# EAGLE design TicTocTrac_top_v1.0 (EAGLE 6.1)
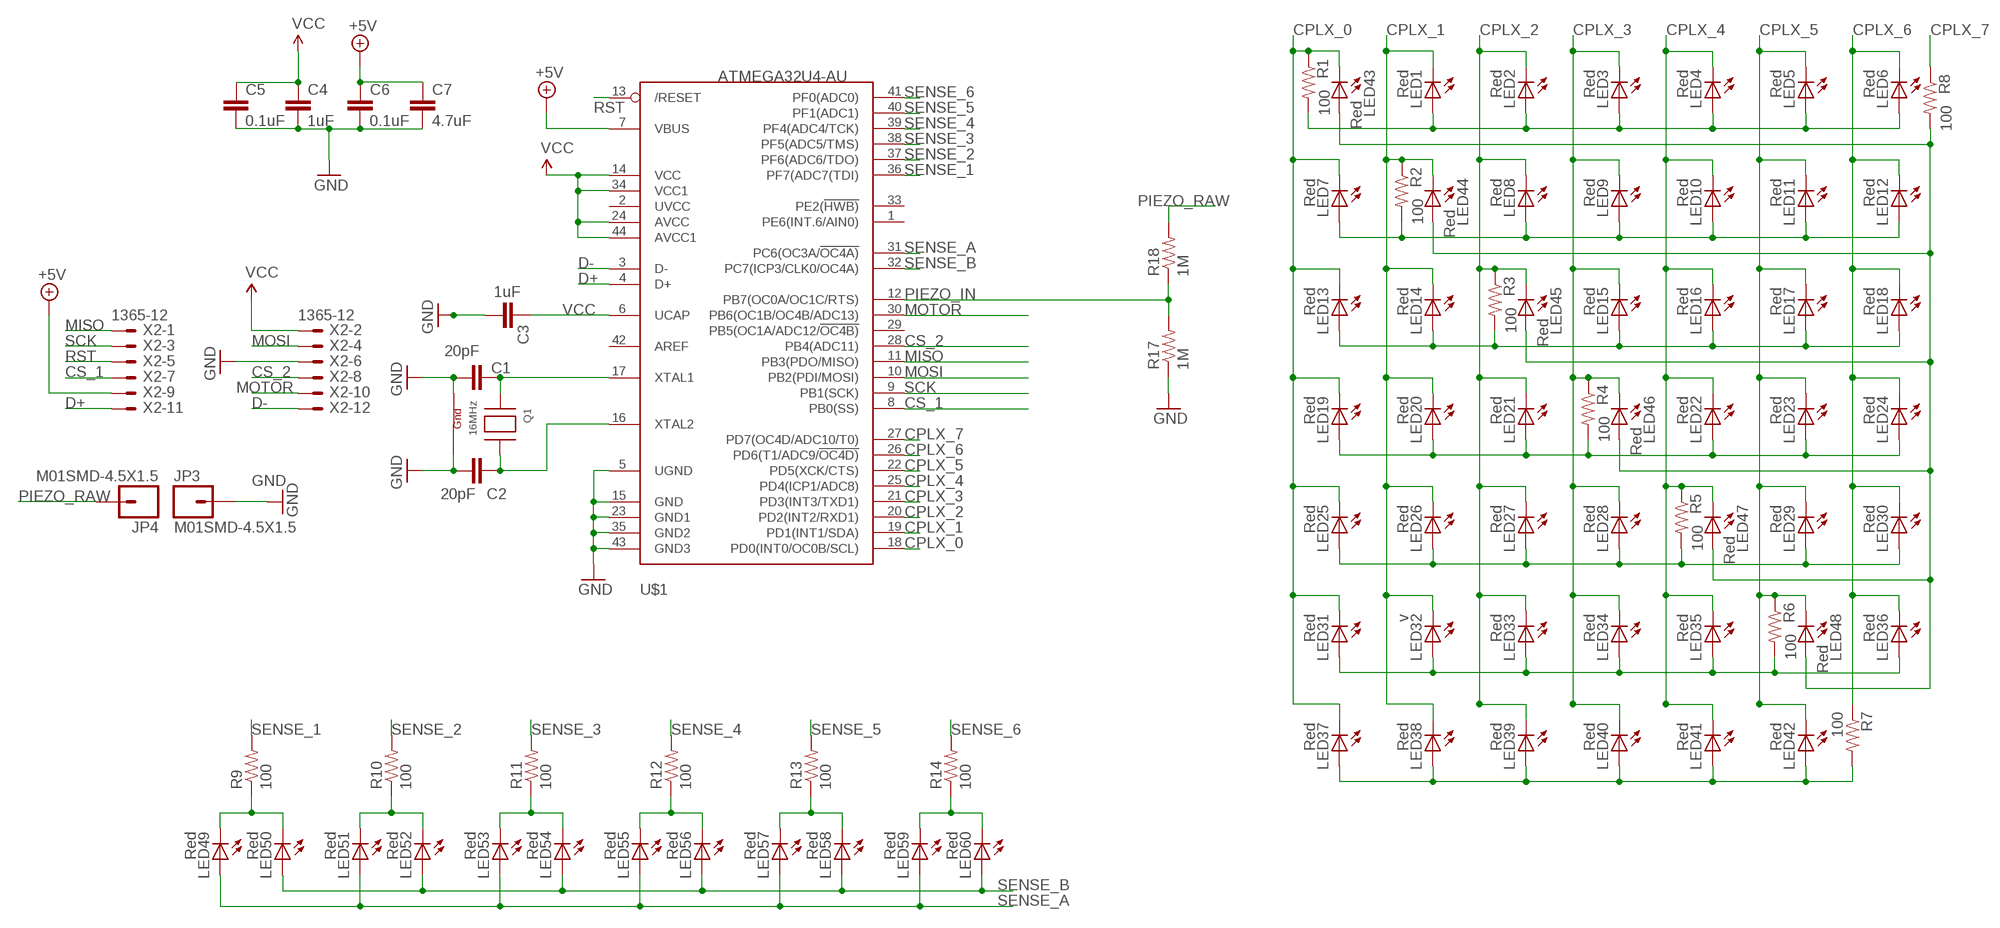
[diagram p0: schematic, sheet 1]

## Parts
C1  20pF  CAP0402-CAP  [0402-CAP]
C2  20pF  CAP0402-CAP  [0402-CAP]
C3  1uF  CAP0402-CAP  [0402-CAP]
C4  1uF  CAP0402-CAP  [0402-CAP]
C5  0.1uF  CAP0402-CAP  [0402-CAP]
C6  0.1uF  CAP0402-CAP  [0402-CAP]
C7  4.7uF  CAP0402-CAP  [0402-CAP]
JP3  M01SMD-4.5X1.5  [PAD-1.5X4.5]
JP4  M01SMD-4.5X1.5  [PAD-1.5X4.5]
LED1  Red  LED0603  [LED-0603]
LED2  Red  LED0603  [LED-0603]
LED3  Red  LED0603  [LED-0603]
LED4  Red  LED0603  [LED-0603]
LED5  Red  LED0603  [LED-0603]
LED6  Red  LED0603  [LED-0603]
LED7  Red  LED0603  [LED-0603]
LED8  Red  LED0603  [LED-0603]
LED9  Red  LED0603  [LED-0603]
LED10  Red  LED0603  [LED-0603]
LED11  Red  LED0603  [LED-0603]
LED12  Red  LED0603  [LED-0603]
LED13  Red  LED0603  [LED-0603]
LED14  Red  LED0603  [LED-0603]
LED15  Red  LED0603  [LED-0603]
LED16  Red  LED0603  [LED-0603]
LED17  Red  LED0603  [LED-0603]
LED18  Red  LED0603  [LED-0603]
LED19  Red  LED0603  [LED-0603]
LED20  Red  LED0603  [LED-0603]
LED21  Red  LED0603  [LED-0603]
LED22  Red  LED0603  [LED-0603]
LED23  Red  LED0603  [LED-0603]
LED24  Red  LED0603  [LED-0603]
LED25  Red  LED0603  [LED-0603]
LED26  Red  LED0603  [LED-0603]
LED27  Red  LED0603  [LED-0603]
LED28  Red  LED0603  [LED-0603]
LED29  Red  LED0603  [LED-0603]
LED30  Red  LED0603  [LED-0603]
LED31  Red  LED0603  [LED-0603]
LED32  v  LED0603  [LED-0603]
LED33  Red  LED0603  [LED-0603]
LED34  Red  LED0603  [LED-0603]
LED35  Red  LED0603  [LED-0603]
LED36  Red  LED0603  [LED-0603]
LED37  Red  LED0603  [LED-0603]
LED38  Red  LED0603  [LED-0603]
LED39  Red  LED0603  [LED-0603]
LED40  Red  LED0603  [LED-0603]
LED41  Red  LED0603  [LED-0603]
LED42  Red  LED0603  [LED-0603]
LED43  Red  LED0603  [LED-0603]
LED44  Red  LED0603  [LED-0603]
LED45  Red  LED0603  [LED-0603]
LED46  Red  LED0603  [LED-0603]
LED47  Red  LED0603  [LED-0603]
LED48  Red  LED0603  [LED-0603]
LED49  Red  LED0603  [LED-0603]
LED50  Red  LED0603  [LED-0603]
LED51  Red  LED0603  [LED-0603]
LED52  Red  LED0603  [LED-0603]
LED53  Red  LED0603  [LED-0603]
LED54  Red  LED0603  [LED-0603]
LED55  Red  LED0603  [LED-0603]
LED56  Red  LED0603  [LED-0603]
LED57  Red  LED0603  [LED-0603]
LED58  Red  LED0603  [LED-0603]
LED59  Red  LED0603  [LED-0603]
LED60  Red  LED0603  [LED-0603]
Q1  16MHz  XTAL-4-3225  [NX3225]
R1  100  RESISTOR0402-RES  [0402-RES]
R2  100  RESISTOR0402-RES  [0402-RES]
R3  100  RESISTOR0402-RES  [0402-RES]
R4  100  RESISTOR0402-RES  [0402-RES]
R5  100  RESISTOR0402-RES  [0402-RES]
R6  100  RESISTOR0402-RES  [0402-RES]
R7  100  RESISTOR0402-RES  [0402-RES]
R8  100  RESISTOR0402-RES  [0402-RES]
R9  100  RESISTOR0402-RES  [0402-RES]
R10  100  RESISTOR0402-RES  [0402-RES]
R11  100  RESISTOR0402-RES  [0402-RES]
R12  100  RESISTOR0402-RES  [0402-RES]
R13  100  RESISTOR0402-RES  [0402-RES]
R14  100  RESISTOR0402-RES  [0402-RES]
R17  1M  RESISTOR0805-RES  [0805]
R18  1M  RESISTOR0805-RES  [0805]
U$1  ATMEGA32U4-AU  [TQFP44]
X2  1365-12  [1365-12]

## Nets
+5V: C6.1 C7.1 U$1.7(VBUS) X2.9
CPLX_0: LED7.C LED13.C LED19.C LED25.C LED31.C LED37.C LED43.C R1.1 U$1.18(PD0(INT0/OC0B/SCL))
CPLX_1: LED1.C LED14.C LED20.C LED26.C LED32.C LED38.C LED44.C R2.1 U$1.19(PD1(INT1/SDA))
CPLX_2: LED2.C LED8.C LED21.C LED27.C LED33.C LED39.C LED45.C R3.1 U$1.20(PD2(INT2/RXD1))
CPLX_3: LED3.C LED9.C LED15.C LED28.C LED34.C LED40.C LED46.C R4.1 U$1.21(PD3(INT3/TXD1))
CPLX_4: LED4.C LED10.C LED16.C LED22.C LED35.C LED41.C LED47.C R5.1 U$1.25(PD4(ICP1/ADC8))
CPLX_5: LED5.C LED11.C LED17.C LED23.C LED29.C LED42.C LED48.C R6.1 U$1.22(PD5(XCK/CTS))
CPLX_6: LED6.C LED12.C LED18.C LED24.C LED30.C LED36.C R7.1 U$1.26(PD6(T1/ADC9/!OC4D))
CPLX_7: R8.1 U$1.27(PD7(OC4D/ADC10/T0))
CS_1: U$1.8(PB0(SS)) X2.7
CS_2: U$1.28(PB4(ADC11)) X2.8
D+: U$1.4(D+) X2.11
D-: U$1.3(D-) X2.12
GND: C1.2 C2.2 C3.2 C4.2 C5.2 C6.2 C7.2 JP3.P$1 Q1.2(G2) Q1.4(G1) R17.1 U$1.5(UGND) U$1.15(GND) U$1.23(GND1) U$1.35(GND2) U$1.43(GND3) X2.6
MISO: U$1.11(PB3(PDO/MISO)) X2.1
MOSI: U$1.10(PB2(PDI/MOSI)) X2.4
MOTOR: U$1.30(PB6(OC1B/OC4B/ADC13)) X2.10
N$2: C2.1 Q1.3(X2) U$1.16(XTAL2)
N$6: C1.1 Q1.1(X1) U$1.17(XTAL1)
N$12: LED19.A LED20.A LED21.A LED22.A LED23.A LED24.A R4.2
N$13: LED1.A LED2.A LED3.A LED4.A LED5.A LED6.A R1.2
N$14: LED7.A LED8.A LED9.A LED10.A LED11.A LED12.A R2.2
N$15: LED25.A LED26.A LED27.A LED28.A LED29.A LED30.A R5.2
N$16: LED13.A LED14.A LED15.A LED16.A LED17.A LED18.A R3.2
N$17: LED43.A LED44.A LED45.A LED46.A LED47.A LED48.A R8.2
N$18: LED37.A LED38.A LED39.A LED40.A LED41.A LED42.A R7.2
N$19: LED31.A LED32.A LED33.A LED34.A LED35.A LED36.A R6.2
N$21: LED49.C LED50.C R9.1
N$22: LED51.C LED52.C R10.1
N$23: LED53.C LED54.C R11.1
N$24: LED55.C LED56.C R12.1
N$25: LED57.C LED58.C R13.1
N$26: LED59.C LED60.C R14.1
PIEZO_IN: R17.2 R18.1 U$1.12(PB7(OC0A/OC1C/RTS))
PIEZO_RAW: JP4.P$1 R18.2
RST: U$1.13(/RESET) X2.5
SCK: U$1.9(PB1(SCK)) X2.3
SENSE_1: R9.2 U$1.36(PF7(ADC7(TDI))
SENSE_2: R10.2 U$1.37(PF6(ADC6/TDO))
SENSE_3: R11.2 U$1.38(PF5(ADC5/TMS))
SENSE_4: R12.2 U$1.39(PF4(ADC4/TCK))
SENSE_5: R13.2 U$1.40(PF1(ADC1))
SENSE_6: R14.2 U$1.41(PF0(ADC0))
SENSE_A: LED49.A LED51.A LED53.A LED55.A LED57.A LED59.A U$1.31(PC6(OC3A/!OC4A))
SENSE_B: LED50.A LED52.A LED54.A LED56.A LED58.A LED60.A U$1.32(PC7(ICP3/CLK0/OC4A))
VCC: C3.1 C4.1 C5.1 U$1.6(UCAP) U$1.14(VCC) U$1.24(AVCC) U$1.34(VCC1) U$1.44(AVCC1) X2.2
Unconnected: U$1.1(PE6(INT.6/AIN0)) U$1.2(UVCC) U$1.29(PB5(OC1A/ADC12/!OC4B)) U$1.33(PE2(!HWB)) U$1.42(AREF)

## Library data of the parts
C1-C7 = SparkFun:CAP: Capacitor Standard 0603 ceramic capacitor, and 0.1" leaded capacitor.
JP3 JP4 = SparkFun-Connectors:M01: Header 1 Standard 1-pin 0.1" header. Use with straight break away headers (SKU : PRT-00116), right angle break away headers (PRT-00553), swiss pins (PRT-00743), machine pins (PRT-00117), and female headers (PRT-00115).
LED1-LED60 = SparkFun:LED: LEDs Standard schematic elements and footprints for 5mm, 3mm, 1206, and 0603 sized LEDs. 5mm - Spark Fun Electronics SKU : COM-00529 (and others)
Q1 = adafruit:XTAL-4: Classic 4-pin 3.2 x 2.5mm crystal
R1-R14 R17 R18 = SparkFun:RESISTOR: Resistor Basic schematic elements and footprints for 0603, 1206, and PTH resistors.
U$1 = adafruit:ATMEGA32U4: http://www.ladyada.net/library/eagle
X2 = con-leotronics:1365-12: DUAL ROW STRAIGHT HEADER 1364 SERIES. 1.27mm x 1.27mm. Without Fixing Post. SMT Source: http://www.leotronics.co.uk/Conexcon/Data%20Sheets/sec.%20A/1364ing.pdf; OC_FARNELL: unknown; OC_NEWARK: unknown

## Board
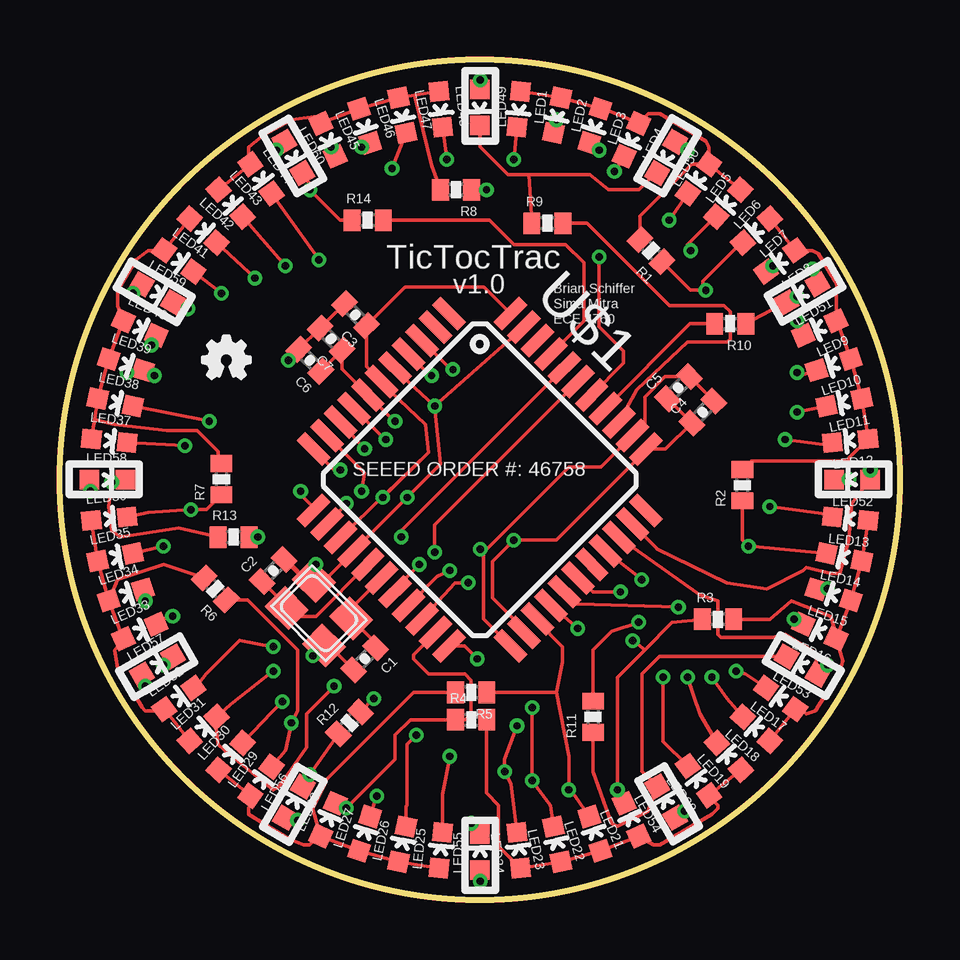
[diagram p1: board, top side]
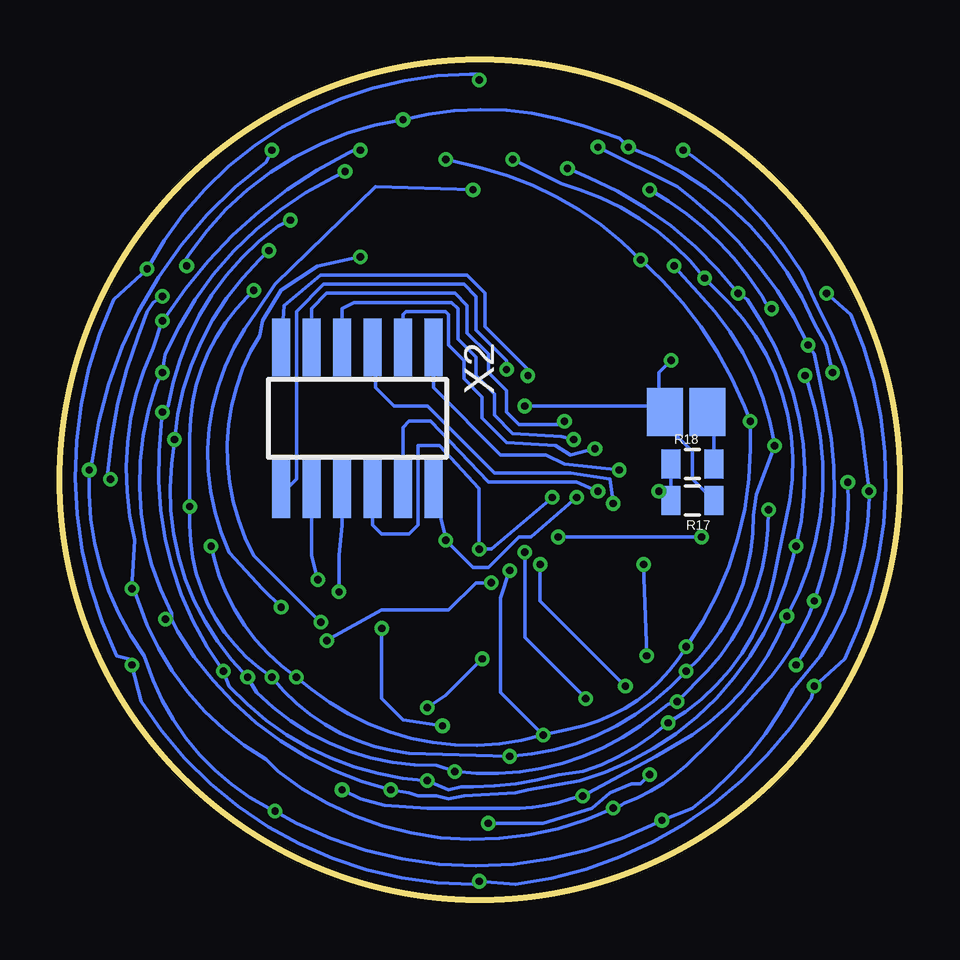
[diagram p2: board, bottom side, seen from below]

Size 35 x 35 mm. Coordinates in mm from the lower left corner, seen from the top.
Outline: circle at 17.5,17.5 radius 17.5
Copper layers (1*16): Top 0.035mm / dielectric 1.5mm / Bottom 0.035mm
Design rules: minimum track width 6mil, minimum drill 12mil, track to track 6mil, track to pad 6mil, pad to pad 6mil, via to via 6mil, smd to smd 0mil, copper to edge 10mil, drill to drill 10mil, minimum pad ring 10mil, minimum via ring 6mil, stop-mask expansion 2mil, vias tented up to drill 100mil, thermal gap 10mil

### Footprints (pad centres in the part's own frame; a part is rotated, then mirrored left to right if it is on the bottom)
0402-CAP = smd 0.7 x 0.9: 1 -0.65,0; 2 0.65,0
PAD-1.5X4.5 = smd 1.5 x 2: P$1 0,0
LED-0603 = smd 0.8 x 0.8: A 0,-0.75; C 0,0.75
NX3225 = smd 1.4 x 1.2: 1 -1.1,-0.8; 2 1.1,-0.8; 3 1.1,0.8; 4 -1.1,0.8
0402-RES = smd 0.7 x 0.9: 1 -0.65,0; 2 0.65,0
0805 = smd 0.8 x 1.2: 1 -0.9,0; 2 0.9,0
TQFP44 = smd 1.5 x 0.5: 1 -5.8,4; 2 -5.8,3.2; 3 -5.8,2.4; 4 -5.8,1.6; 5 -5.8,0.8; 6 -5.8,0; 7 -5.8,-0.8; 8 -5.8,-1.6; 9 -5.8,-2.4; 10 -5.8,-3.2; 11 -5.8,-4; 23 5.8,-4; 24 5.8,-3.2; 25 5.8,-2.4; 26 5.8,-1.6; 27 5.8,-0.8; 28 5.8,0; 29 5.8,0.8; 30 5.8,1.6; 31 5.8,2.4; 32 5.8,3.2; 33 5.8,4 | smd 0.5 x 1.5: 12 -4,-5.8; 13 -3.2,-5.8; 14 -2.4,-5.8; 15 -1.6,-5.8; 16 -0.8,-5.8; 17 0,-5.8; 18 0.8,-5.8; 19 1.6,-5.8; 20 2.4,-5.8; 21 3.2,-5.8; 22 4,-5.8; 34 4,5.8; 35 3.2,5.8; 36 2.4,5.8; 37 1.6,5.8; 38 0.8,5.8; 39 0,5.8; 40 -0.8,5.8; 41 -1.6,5.8; 42 -2.4,5.8; 43 -3.2,5.8; 44 -4,5.8
1365-12 = smd 0.76 x 2.4: 1 -3.175,-2.95; 2 -3.175,2.95; 3 -1.905,-2.95; 4 -1.905,2.95; 5 -0.635,-2.95; 6 -0.635,2.95; 7 0.635,-2.95; 8 0.635,2.95; 9 1.905,-2.95; 10 1.905,2.95; 11 3.175,-2.95; 12 3.175,2.95

### Placement (x,y rotation side)
C1  12.7,10.03 225 top
C2  8.89,13.72 45 top
C3  12.32,24.38 135 top
C4  26.8,20.32 45 top
C5  25.78,21.34 45 top
C6  10.41,22.48 135 top
C7  11.3,23.37 135 top
JP3  9.78,20.32 0 bottom
JP4  8,20.32 0 bottom
LED1  19.13,32.94 174 top
LED2  20.73,32.69 168 top
LED3  22.3,32.26 162 top
LED4  23.82,31.67 156 top
LED5  26.62,30.05 144 top
LED6  27.86,29.03 138 top
LED7  29.03,27.89 132 top
LED8  30.05,26.62 126 top
LED9  31.67,23.82 114 top
LED10  32.26,22.3 108 top
LED11  32.69,20.73 102 top
LED12  32.94,19.13 96 top
LED13  32.94,15.87 84 top
LED14  32.69,14.27 78 top
LED15  32.26,12.7 72 top
LED16  31.67,11.18 66 top
LED17  30.05,8.38 54 top
LED18  29.03,7.11 48 top
LED19  27.89,5.97 42 top
LED20  26.62,4.95 36 top
LED21  23.82,3.33 24 top
LED22  22.3,2.74 18 top
LED23  20.73,2.31 12 top
LED24  19.13,2.06 6 top
LED25  15.87,2.06 354 top
LED26  14.27,2.31 348 top
LED27  12.7,2.74 342 top
LED28  11.18,3.33 336 top
LED29  8.38,4.93 324 top
LED30  7.11,5.97 318 top
LED31  5.97,7.11 312 top
LED32  4.95,8.38 306 top
LED33  3.33,11.18 294 top
LED34  2.74,12.7 288 top
LED35  2.31,14.27 282 top
LED36  2.06,15.87 276 top
LED37  2.06,19.13 264 top
LED38  2.31,20.73 258 top
LED39  2.74,22.3 252 top
LED40  3.33,23.82 246 top
LED41  4.95,26.62 234 top
LED42  5.97,27.89 228 top
LED43  7.11,29.03 222 top
LED44  8.38,30.05 216 top
LED45  11.18,31.67 204 top
LED46  12.7,32.26 198 top
LED47  14.27,32.69 192 top
LED48  15.87,32.94 186 top
LED49  17.5,33.02 180 top
LED50  25.27,30.94 150 top
LED51  30.94,25.27 120 top
LED52  33.02,17.5 90 top
LED53  30.94,9.75 60 top
LED54  25.27,4.06 30 top
LED55  17.5,1.98 0 top
LED56  9.75,4.06 330 top
LED57  4.06,9.75 300 top
LED58  1.98,17.5 270 top
LED59  4.06,25.27 240 top
LED60  9.73,30.94 210 top
Q1  10.79,11.94 135 top
R1  24.64,27.05 135 top
R2  28.45,17.27 90 top
R3  27.43,11.68 0 top
R4  17.14,7.49 0 top
R5  17.14,8.64 180 top
R6  6.48,12.95 135 top
R7  6.73,17.53 90 top
R8  16.51,29.59 180 top
R9  20.32,28.19 0 top
R10  27.94,24 180 top
R11  22.22,7.62 90 top
R12  12.06,7.37 45 top
R13  7.24,15.11 0 top
R14  12.83,28.32 0 top
R17  8.64,16.64 180 bottom
R18  8.64,18.16 0 bottom
U$1  17.5,17.5 315 top
U$2  [OSHW_FILLX70_NOTEXT]  5.94,21.72 0 top
X2  22.61,20.07 180 bottom

### Tracks (layer width: path | path; a pad name or v marks a point on that pad's centre or on a via)
+5V  (via drill 0.3)
  Top 0.152: C6.1 C7.1 11.76,22.11 U$1.7 13.93,19.94 v13.97,19.94
  Bottom 0.152: v13.97,19.94 14.1,19.81 15.87,19.81 16.38,20.32 16.38,21.21 17.14,21.97 17.14,22.73 18.03,23.62 18.03,24.76 18.54,25.27 23.88,25.27 24.51,24.64 X2.9
CPLX_0  (via drill 0.3)
  Top 0.152: LED7.C 28.4,27.39 26.8,25.78 26.8,25.53 v26.92,25.4 26.29,25.4 R1.1 | v29.59,16.38 32.38,16 32.26,16 LED13.C | v26.16,9.27 26.67,7.75 LED19.C | LED25.C 15.95,4.4 v16.26,5.97 | v8.89,9.52 7.11,8.13 LED31.C 6.48,7.49 6.6,6.48 6.86,6.22 8.89,4.57 9.14,4.7 10.29,6.35 10.29,7.75 v11.43,8.89 | LED37.C v5.21,18.92 | LED43.C v9.4,26.42 | U$1.18 13.96,12.95 v14.99,13.97
  Bottom 0.152: v26.92,25.4 27.18,25.15 arc-45 29.59,19.3 v29.59,16.38 29.59,15.62 arc-57 v26.16,9.27 arc-46 20.45,6.1 v16.26,5.97 arc-44 v8.89,9.52 arc-49 6.1,16 5.97,16.89 v5.21,18.92 arc-36 8.38,25.27 v9.4,26.42 | v14.99,13.97 14.99,12.45 v11.43,8.89
CPLX_1  (via drill 0.3)
  Top 0.152: LED14.C v28.7,14.73 28.45,14.99 R2.1 | v25.15,9.27 25.15,6.6 26.18,5.57 LED20.C | v14.86,6.86 14.48,6.48 14.48,3.94 14.43,3.89 LED26.C | v8.89,10.54 7.49,10.79 6.1,9.4 5.59,8.76 | 5.59,8.76 5.59,8.89 | 5.59,8.76 LED32.C | LED38.C v6.22,19.94 | v10.79,26.67 8.89,29.34 | 8.89,29.34 8.89,29.46 | LED44.C 8.89,29.34 | LED1.C v18.92,30.86 | U$1.19 15.72,13.46 v16.26,13.72
  Bottom 0.152: v28.7,14.73 28.57,14.22 arc-41 v25.15,9.27 24.51,8.76 arc-55 v14.86,6.86 | v14.86,6.86 13.72,7.11 arc-48 v8.89,10.54 arc-35 6.22,18.8 v6.22,19.94 6.48,20.57 arc-27 v10.79,26.67 arc-32 17.4,30.48 v18.92,30.86 | v16.26,13.72 16.64,12.57 16.64,8.64 v14.86,6.86
CPLX_2  (via drill 0.3)
  Top 0.152: LED27.C v13.21,4.32 | v4.7,11.81 4.7,11.94 3.94,11.43 LED33.C 4.08,11.53 | LED21.C v23.24,4.57 23.24,9.27 24.38,10.41 | LED39.C v3.94,21.84 v2.79,21.97 | LED8.C v29.72,26.42 | v20.7,32.51 20.83,32.51 20.57,32 LED2.C | LED45.C v11.3,31.37 | 24.38,10.41 25.51,11.56 R3.1 | U$1.20 16.47,13.21 v17.02,13.21 | 23.88,10.92 v23.88,10.79 24.38,10.41
  Bottom 0.152: v23.24,4.57 22.48,4.19 21.46,3.94 19.68,3.81 16.38,3.81 arc-21 13.72,4.19 v13.21,4.32 10.16,5.97 8.64,6.86 arc-35 v4.7,11.81 arc-47 3.81,21.46 v3.94,21.84 | v29.72,26.42 29.84,26.54 29.59,26.92 arc47 v20.7,32.51 arc33 13.21,32.26 11.68,31.75 v11.3,31.37 arc47 3.56,24 3.05,23.11 v2.79,21.97 | v23.88,10.79 21.59,12.06 18.8,12.06 17.65,13.21 v17.02,13.21
CPLX_3  (via drill 0.3)
  Top 0.152: LED3.C 22.22,31.24 v22.48,31.24 | v30.73,24.13 30.73,24 LED9.C | LED15.C v32,12.95 | LED28.C v11.94,3.81 13.97,5.84 13.97,6.86 14.6,7.49 R4.1 16.89,7.49 17.14,7.75 17.14,9.14 16.89,9.4 15.37,9.4 14.73,10.03 14.73,10.21 U$1.21 | LED34.C v3.56,12.45 | LED40.C v3.81,23.11 | LED46.C v12.57,31.37
  Bottom 0.152: v22.48,31.24 22.73,31.24 22.99,31.11 arc-31 30.61,24.26 v30.73,24.13 31.11,22.99 arc-39 31.88,14.99 v32,12.95 32,13.21 31.75,12.45 arc-41 26.42,5.84 25.91,5.33 arc-64 v11.94,3.81 arc-22 LED28.C arc-22 8.89,5.59 arc-6 5.84,8.76 arc-20 3.81,11.81 v3.56,12.45 arc-32 3.05,20.32 3.56,22.73 v3.81,23.11 arc-26 8.64,29.21 9.27,29.72 v12.57,31.37
CPLX_4  (via drill 0.3)
  Top 0.152: LED4.C v23.11,30.35 | v30.73,21.97 30.86,21.84 LED10.C | LED16.C 30.99,11.68 v30.61,11.68 | LED22.C 21.46,4.32 v21.21,4.57 21.21,5.97 20.7,8.64 | LED35.C v4.32,14.73 | LED41.C v6.73,25.27 | LED47.C v13.84,30.48 | R5.1 20.7,8.64 | 20.7,8.64 20.95,9.91 20.95,10.54 19.9,11.59 U$1.25
  Bottom 0.152: v23.11,30.35 23.62,30.1 arc-40 30.61,22.73 v30.73,21.97 30.99,21.46 arc-47 30.35,11.94 30.35,11.68 | v30.61,11.68 30.35,11.68 | 30.35,11.68 30.1,11.18 arc-45 v21.21,4.57 20.45,4.44 20.07,4.32 19.3,4.32 18.8,4.19 18.16,4.32 16,4.44 15.49,4.57 13.33,4.95 arc-60 4.44,14.22 v4.32,14.73 arc-45 5.71,24 6.35,25.02 v6.73,25.27 arc-29 12.95,30.1 v13.84,30.48
CPLX_5  (via drill 0.3)
  Top 0.152: LED5.C v25.4,28.32 | v28.19,9.52 28.57,9.4 LED17.C | v30.73,20.32 LED11.C | LED23.C 20.45,3.94 v19.68,4.95 v19.68,8 | LED29.C 9.4,6.22 v9.65,7.37 9.91,7.87 9.91,10.41 7.83,12.49 R6.1 | LED42.C v8.13,25.91 | LED48.C v16.13,30.86 | U$1.22 16.86,10.57 v17.4,10.03
  Bottom 0.152: v25.4,28.32 25.91,28.07 arc-45 30.48,20.57 v30.73,20.32 30.86,18.67 arc-40 v28.19,9.52 27.94,8.89 arc-44 v19.68,4.95 18.8,4.57 18.29,4.7 17.78,4.7 arc-16 14.22,5.21 13.21,5.33 arc-23 v9.65,7.37 arc-52 5.08,14.22 arc-2 4.57,16.64 arc-53 7.11,24.89 v8.13,25.91 arc-34 13.33,29.59 14.1,29.84 v16.13,30.86 | v17.4,10.03 18.92,8.51 v19.68,8
CPLX_6  (via drill 0.3)
  Top 0.152: LED6.C 27.33,28.47 26.16,27.3 26.16,27.18 v26.29,27.05 | 32.07,18.92 LED12.C 32.13,18.92 v30.23,19.18 | v27.18,9.27 27.81,8.38 LED18.C | LED24.C 18.92,3.81 18.8,4.83 v18.54,5.33 18.54,5.84 v19.05,7.24 | LED30.C v9.27,8.25 | LED36.C 3.68,16.13 v5.46,16.26 6.11,16.26 R7.1 | U$1.26 v21.59,11.3
  Bottom 0.152: v26.29,27.05 26.67,26.67 arc-41 v30.23,19.18 30.35,18.16 arc-51 v27.18,9.27 26.8,8.64 arc-46 19.3,5.59 v18.54,5.33 arc-42 10.79,7.24 9.65,8.13 v9.27,8.25 8,9.52 arc-43 v5.46,16.26 | v21.59,11.3 21.59,8.38 20.7,7.49 v19.05,7.24
CPLX_7  (via drill 0.3)
  Top 0.152: R8.1 v17.78,29.59 | v25.78,12.19 21.55,12.32 U$1.27
  Bottom 0.152: v17.78,29.59 21.84,29.72 26.03,25.65 26.8,24.51 arc-63 27.94,14.48 26.54,12.95 v25.78,12.19
CS_1  (via drill 0.3)
  Top 0.152: U$1.8 13.56,19.18 v13.59,19.18
  Bottom 0.152: v13.59,19.18 14.1,19.3 16.13,19.43 16.89,20.19 16.89,21.08 17.65,21.84 17.65,22.61 18.41,23.37 18.41,24.64 18.67,24.89 22.73,24.89 23.24,24.64 X2.7
CS_2  (via drill 0.3)
  Top 0.152: U$1.28 22.22,12.83 v23.37,12.83
  Bottom 0.152: v23.37,12.83 23.37,14.35 23.24,15.62 X2.8 23.24,15.75
D+  (via drill 0.3)
  Top 0.152: U$1.4 15.42,21.84 v15.49,21.84
  Bottom 0.152: X2.11 25.65,24.76 24.13,26.03 18.03,26.03 17.27,25.27 17.27,23.88 15.49,22.1 v15.49,21.84
D-  (via drill 0.3)
  Top 0.152: U$1.3 16.13,22.27 v16.38,22.1
  Bottom 0.152: X2.12 25.78,16.89 25.15,17.53 25.15,24.51 24,25.65 18.16,25.65 17.65,25.15 17.65,23.75 16.38,22.48 v16.38,22.1
GND  (via drill 0.3)
  Top 0.152: Q1.2 10.24,13.28 C2.2 9.45,14.18 10.41,13.21 10.92,13.21 v14.48,16.76 15.87,18.16 v15.62,20.57 | Q1.2 11.02,13.28 U$1.15 | C1.2 11.22,10.59 Q1.4 10.57,10.16 v10.54,10.16 | v10.67,13.97 10.79,13.84 Q1.2 | C3.2 C7.2 C6.2 9.4,22.48 v9.52,22.48 | C4.2 C5.2 25.22,21.8 24.38,20.95 24.38,19.86 U$1.35 22.56,18.03 21.21,18.03 17.65,14.48 | U$1.5 13.96,22.1 v15.62,20.57 | v15.62,20.57 U$1.43 | U$1.23 17.65,11.69 17.65,14.48 | 17.65,14.48 v17.53,14.6
  Bottom 0.152: v10.54,10.16 v10.67,13.97 | R17.1 8.64,17.54 8.64,18.67 9.65,19.68 9.65,20.07 9.78,20.19 JP3.P$1 10.03,20.57 | v15.62,20.57 10.03,20.57 | 10.03,20.57 10.03,21.97 v9.52,22.48 | v14.48,16.76 17.02,14.6 v17.53,14.6 17.53,17.14 19.18,18.92 20.07,18.92 20.07,15.62 20.45,15.24 21.59,15.24 21.97,15.62 X2.6
MISO  (via drill 0.3)
  Top 0.152: U$1.11 11.43,17.91 v11.68,17.91
  Bottom 0.152: v11.68,17.91 13.97,18.16 14.73,18.54 16.64,18.54 19.43,21.34 19.43,21.97 19.3,22.1 X2.1
MOSI  (via drill 0.3)
  Top 0.152: U$1.10 12.7,17.78 v12.57,17.02
  Bottom 0.152: v12.57,17.02 13.46,17.4 17.14,17.4 19.56,19.94 20.45,19.94 20.7,19.68 X2.4 20.7,16.89
MOTOR  (via drill 0.3)
  Top 0.152: U$1.30 v24.26,13.33
  Bottom 0.152: v24.26,13.33 24.51,14.35 X2.10
N$2
  Top 0.152: U$1.16 12.82,13.96 10.67,11.81 9.79,11.81 Q1.3 9.45,12.23 C2.1
N$6
  Top 0.152: U$1.17 12.14,12.14 Q1.1 13.16,10.7 C1.1
N$12
  Top 0.152: LED19.A LED20.A 27.06,4.31 27.43,3.94 27.43,3.81 27.18,3.56 25.02,2.29 24.74,2.29 LED21.A LED22.A LED23.A LED24.A 18.29,2.23 18.29,3.94 17.78,4.44 17.78,7.48 | 17.78,7.48 17.78,7.49 | R4.2 17.78,7.48
N$13
  Top 0.152: LED1.A LED2.A LED3.A 22.73,33.02 22.61,32.89 22.86,32.89 LED4.A | LED5.A LED6.A | LED4.A 24.1,32.38 24,32.38 | LED4.A 24.54,32.77 25.02,32.77 26.92,31.62 27.06,31.36 LED5.A | LED5.A 26.34,30.65 24.18,28.5 R1.2
N$14
  Top 0.152: LED7.A LED8.A 30.74,27.06 31.37,27.05 31.62,26.92 32.38,25.65 32.36,25.12 LED9.A 32.38,24.13 LED10.A LED11.A LED12.A 32.89,18.41 32.89,18.29 28.81,18.29 R2.2
N$15
  Top 0.152: LED25.A LED26.A LED27.A LED28.A | LED30.A LED29.A 7.94,4 7.87,3.81 7.87,3.56 9.52,2.54 10.16,2.29 10.41,2.29 10.77,2.64 LED28.A | R5.2 14.73,8.64 11.05,4.95 11.05,4.83 10.54,3.81 LED28.A
N$16
  Top 0.152: LED13.A LED14.A LED15.A LED16.A | LED18.A LED17.A 30.92,7.94 31.11,7.75 31.5,7.87 32.13,8.89 32.51,9.52 32.64,9.96 LED16.A | R3.2 29.59,11.68 30.48,12.45 32.13,11.81 32.38,10.92 | 32.26,10.92 32.38,10.92 | 32.38,10.92 32.38,10.79 LED16.A
N$17
  Top 0.152: LED43.A LED44.A 7.87,30.72 7.87,31.37 8.51,31.88 9.65,32.51 10.59,32.64 LED45.A LED46.A LED47.A 14.79,33.53 | 14.79,33.53 LED48.A | R8.2 15.49,30.61 14.79,33.53
N$18
  Top 0.152: LED37.A 1.44,20.01 | 1.44,20.01 LED38.A LED39.A LED40.A 2.41,24.74 2.41,25.4 3.17,26.67 3.68,27.05 3.93,27.06 LED41.A LED42.A | R7.2 6.6,18.3 6.6,18.67 5.71,19.56 4.44,19.56 2.29,19.81 1.44,20.01
N$19
  Top 0.152: LED31.A LED32.A 4,7.94 3.94,7.87 3.56,7.87 3.43,8 3.05,8.64 2.41,9.65 2.29,10.39 LED33.A LED34.A | LED34.A LED35.A LED36.A | LED34.A 2.41,13.33 4.32,13.97 R6.2
N$21
  Top 0.152: 17.4,32 17.4,32.17 LED49.C 17.5,31.39 18.67,30.23 19.56,30.23 | 19.56,30.23 22.1,30.23 22.86,29.59 24.13,29.59 24.83,30.29 | 24.83,30.29 24.89,30.35 | LED50.C 24.83,30.29 | R9.1 19.56,30.23
N$22  (via drill 0.3)
  Top 0.152: v30.73,25.15 LED51.C R10.1 | v32.89,17.53 32.89,17.65 LED52.C
  Bottom 0.152: v30.73,25.15 31.11,24.89 31.37,24.51 31.75,23.49 arc-16 33.02,17.78 v32.89,17.53
N$23
  Top 0.152: LED53.C 24.99,10.13 24.26,9.4 24.26,5.35 LED54.C 24.51,3.68 23.24,3.05 22.99,3.17 22.22,5.33 R11.1
N$24  (via drill 0.3)
  Top 0.152: LED56.C v10.41,5.21 R12.1 | v17.14,3.17 17.27,2.92 LED55.C
  Bottom 0.152: v10.41,5.21 10.79,4.83 11.18,4.83 12.06,4.44 12.83,3.81 14.86,3.17 v17.14,3.17
N$25  (via drill 0.3)
  Top 0.152: 4.95,10.03 4.86,10.13 LED57.C v4.32,9.78 | LED58.C 2.67,17.53 2.16,17.53 v2.16,17.4 2.03,16.38 2.16,15.37 2.54,15.11 4.95,15.49 R13.1
  Bottom 0.152: v4.32,9.78 4.06,10.16 arc-38 v2.16,17.4
N$26  (via drill 0.3)
  Top 0.152: LED59.C 4.82,24.9 v5.33,24.64 | LED60.C 10.41,29.84 v10.41,29.59 11.68,28.32 R14.1
  Bottom 0.152: v5.33,24.64 5.59,24.89 5.71,25.15 6.35,26.03 arc-25 v10.41,29.59
PIEZO_IN  (via drill 0.3)
  Top 0.152: v10.03,17.02 10.16,16.89 10.16,16.76 10.57,16.35 U$1.12
  Bottom 0.152: R18.1 R17.2 9.92,17.02 v10.03,17.02
PIEZO_RAW
  Bottom 0.152: JP4.P$1 7.74,19.8 R18.2
RST  (via drill 0.3)
  Top 0.152: U$1.13 11.94,16.46 v11.94,16.51
  Bottom 0.152: v11.94,16.51 12.06,17.53 13.72,17.78 16.89,17.78 19.68,20.57 21.08,20.57 21.84,21.34 21.84,22.89 X2.5
SCK  (via drill 0.3)
  Top 0.152: U$1.9 12.68,18.8 v12.7,18.8
  Bottom 0.152: v12.7,18.8 13.72,18.54 14.35,18.92 16.38,19.05 17.4,20.07 17.4,20.95 18.16,21.72 18.16,22.48 18.8,23.11 18.8,24.38 18.92,24.51 20.57,24.51 20.7,24.38 X2.3
SENSE_1
  Top 0.152: R9.2 21.97,28.19 25.4,24.76 27.69,24.76 27.94,24.51 27.94,23.37 27.81,23.24 26.16,23.24 24.06,21.27 U$1.36
SENSE_2
  Top 0.152: U$1.37 26.27,24 R10.2
SENSE_3  (via drill 0.3)
  Top 0.152: v24.13,11.56 22.99,11.18 22.22,10.41 R11.2 | U$1.38 23.49,22.36 23.49,22.86 22.48,23.88 v22.48,26.8
  Bottom 0.152: v24.13,11.56 26.92,14.35 arc55 27.05,22.86 26.67,23.49 26.54,24.13 25.78,25.4 24.26,26.42 v22.48,26.8
SENSE_4  (via drill 0.3)
  Top 0.152: R12.2 v13.08,8.38 | v15.62,14.48 15.62,15.62 U$1.39
  Bottom 0.152: v13.08,8.38 15.62,10.92 v15.62,14.48
SENSE_5  (via drill 0.3)
  Top 0.152: R13.2 v8.25,15.11 | v14.22,15.11 14.22,15.37 21.08,22.22 | 21.08,22.22 20.95,22.22 20.95,21.97 | 21.08,22.22 21.08,22.21 U$1.40
  Bottom 0.152: v8.25,15.11 v14.22,15.11
SENSE_6
  Top 0.152: R14.2 17.91,28.32 18.92,27.3 21.08,27.3 21.84,26.54 21.84,24.11 U$1.41
SENSE_A  (via drill 0.3)
  Top 0.152: LED49.A v17.53,34.16 | v31.37,26.29 LED51.A | v32,9.78 LED53.A 31.5,10.29 30.23,11.05 29.72,10.92 27.56,10.92 27.43,11.05 27.43,12.45 26.67,12.7 U$1.31 | LED55.A v17.53,0.76 | LED57.A v3.56,8.89 | LED59.A 3.56,25.53 v3.05,25.27
  Bottom 0.152: v17.53,34.16 17.53,34.42 17.91,34.42 arc-61 v31.37,26.29 32.77,25.02 arc-50 32.64,10.16 32.13,10.03 v32,9.78 31.62,8.25 arc-58 17.78,0.63 17.53,0.63 v17.53,0.76 16,0.63 arc-50 3.68,8.38 v3.56,8.89 2.29,10.03 arc-50 2.03,24.38 v3.05,25.27
SENSE_B  (via drill 0.3)
  Top 0.152: LED50.A v26.16,31.24 | v33.78,17.91 LED52.A 33.02,16.51 32.89,14.99 32.51,13.59 32.13,13.59 31.11,13.84 30.99,13.72 29.46,12.95 27.81,13.21 24.89,14.6 24.89,14.63 U$1.32 | LED54.A v26.03,3.68 | LED56.A v9.91,3.3 | LED58.A v1.27,17.02 | LED60.A 9.4,31.62 v9.02,31.24
  Bottom 0.152: v26.16,31.24 26.42,30.73 arc-46 33.65,18.29 v33.78,17.91 arc-39 31.5,10.16 31.11,9.14 arc-41 26.29,3.81 v26.03,3.68 25.15,3.17 arc-53 10.16,3.17 v9.91,3.3 8.64,3.81 arc-25 4.44,8.76 3.3,10.16 arc-32 1.27,16.76 v1.27,17.02 1.4,18.16 arc-24 3.43,24.76 4.06,26.16 arc-23 8.64,30.99 v9.02,31.24
VCC  (via drill 0.3)
  Top 0.152: C5.1 C4.1 25.25,18.77 U$1.34 24.43,18.71 20.7,14.99 v18.92,14.99 18.03,14.1 18.03,12.57 19.34,11.27 U$1.24 | 15.37,18.63 15.24,19.81 13.4,21.53 U$1.6 12.78,22.22 C3.1 14.38,25.53 17.68,25.53 U$1.44 | 15.37,18.63 U$1.14 | 15.37,18.63 v13.46,16.76
  Bottom 0.152: X2.2 18.92,15.11 v18.92,14.99 17.78,13.84 17.14,13.84 15.87,15.11 15.37,15.11 v13.46,16.76

### Text on the board
tPlace: TicTocTrac | v1.0 | Brian Schiffer | Sima Mitra | ECE 4760 | SEEED ORDER #: 46758